# Altium schematic sheet Pcb Schemetic_Gas Detector.SchDoc
size A; SheetNumber: 1; SheetTotal: 1
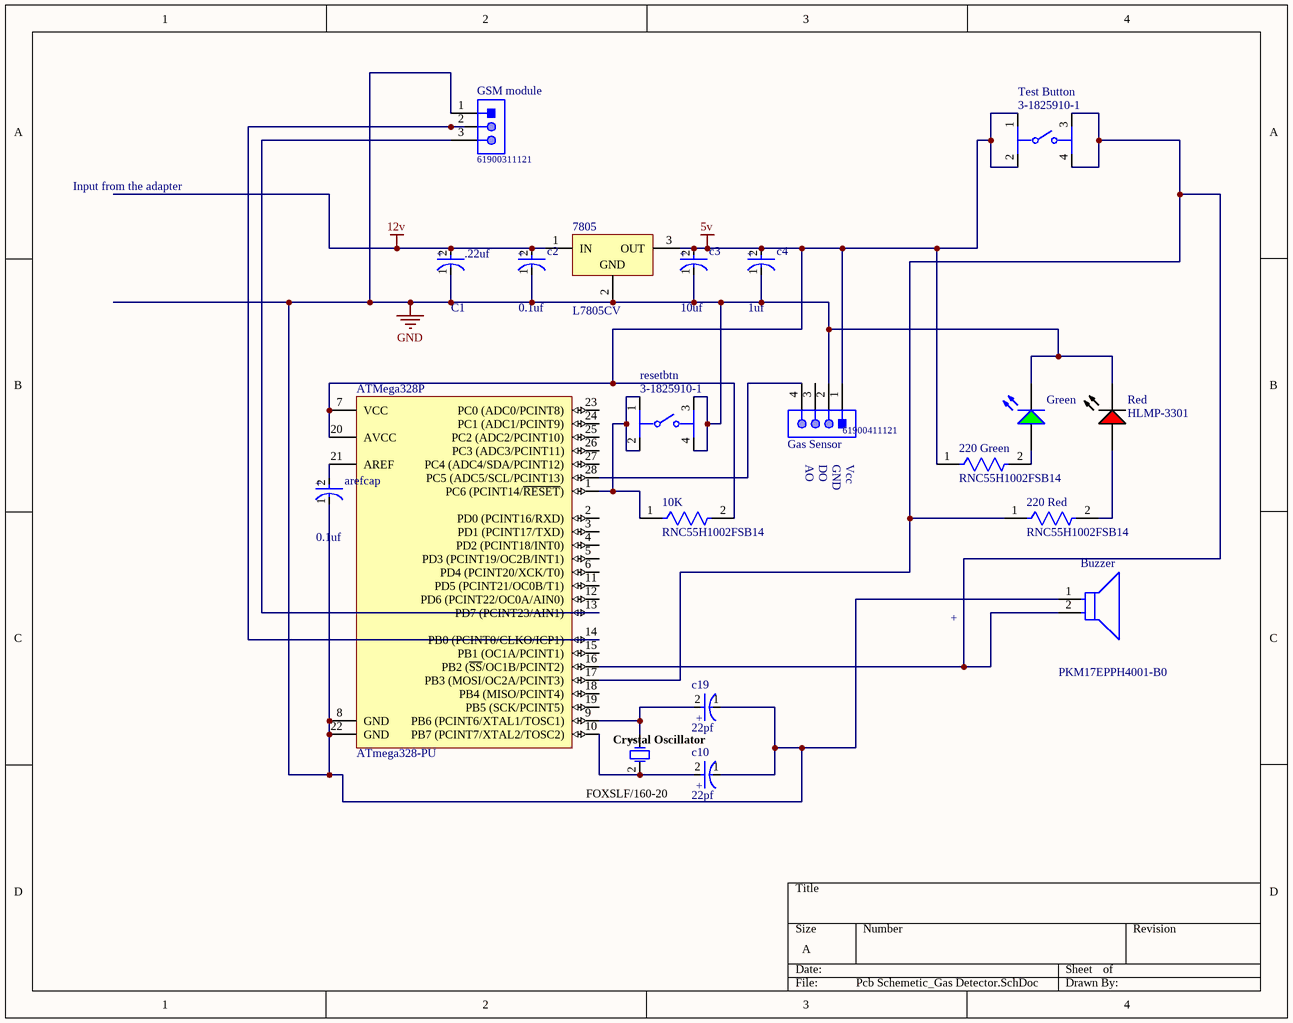
[diagram p0: Pcb Schemetic_Gas Detector.SchDoc]

## Parts
10K  RNC55H1002FSB14  [FP-RNC55-MFG]
220_Green  RNC55H1002FSB14  [FP-RNC55-MFG]
220_Red  RNC55H1002FSB14  [FP-RNC55-MFG]
7805  L7805CV  [TO220]
.22uf  C1  [FP-RAD-TH-D_12_5_0_5-L_25-MFG]
arefcap  0.1uf  [FP-RAD-TH-D_10_0_5-L_20_2-MFG]
ATMega328P  ATmega328-PU  [28P3]
Buzzer  PKM17EPPH4001-B0  [FP-PKM17EPPH4001-B0-MFG]
c2  0.1uf  [FP-RAD-TH-D_10_0_5-L_20_2-MFG]
c3  10uf  [FP-RAD-TH-D_10_0_5-L_20_2-MFG]
c4  1uf  [FP-RAD-TH-D_10_0_5-L_20_2-MFG]
c10  22pf  [FP-RAD-TH-D_10_0_5-L_20_2-MFG]
c19  22pf  [FP-RAD-TH-D_10_0_5-L_20_2-MFG]
Crystal_Oscillator  FOXSLF/160-20  [FOX-FOXSLF160-20]
Gas_Sensor  61900411121  [61900411121]
Green  (no value)  [AVAG-HLMP-3507]
GSM_module  61900311121  [61900311121]
Red  HLMP-3301  [AVAG-HLMP-3301-2]
resetbtn  3-1825910-1  [FP-3-1825910-1-MFG]
Test_Button  3-1825910-1  [FP-3-1825910-1-MFG]

## Nets
5v: 10K.2 220_Green.1 7805.3(OUT) ATMega328P.7(VCC) ATMega328P.20(AVCC) c3.2(A) c4.2(A) Gas_Sensor.1 Test_Button.1 Test_Button.2
12v: 7805.1(IN) .22uf.2(A) c2.2(A)
GND: 7805.2(GND) .22uf.1(C) arefcap.1(C) ATMega328P.8(GND) ATMega328P.22(GND) Buzzer.1 c2.1(C) c3.1(C) c4.1(C) c10.1(C) c19.1(C) Gas_Sensor.2 Green.2(K) GSM_module.1 Red.1(K) resetbtn.3 resetbtn.4
Net10K_1: 10K.1 ATMega328P.1(PC6_(PCINT14/~{RESET})) resetbtn.1 resetbtn.2
Net220_Green_2: 220_Green.2 Green.1(A)
Net220_Red_1: 220_Red.1 ATMega328P.16(PB2_(~{SS}/OC1B/PCINT2)) ATMega328P.17(PB3_(MOSI/OC2A/PCINT3)) Buzzer.2 Test_Button.3 Test_Button.4
Net220_Red_2: 220_Red.2 Red.2(A)
Netarefcap_2: arefcap.2(A) ATMega328P.21(AREF)
NetATMega328P_9: ATMega328P.9(PB6_(PCINT6/XTAL1/TOSC1)) c19.2(A) Crystal_Oscillator.1
NetATMega328P_10: ATMega328P.10(PB7_(PCINT7/XTAL2/TOSC2)) c10.2(A) Crystal_Oscillator.2
NetATMega328P_13: ATMega328P.13(PD7_(PCINT23/AIN1)) GSM_module.3
NetATMega328P_14: ATMega328P.14(PB0_(PCINT0/CLKO/ICP1)) GSM_module.2
NetATMega328P_28: ATMega328P.28(PC5_(ADC5/SCL/PCINT13)) Gas_Sensor.4

Not connected (* = marked no-connect by the designer): ATMega328P 2(PD0_(PCINT16/RXD)) 3(PD1_(PCINT17/TXD)) 4(PD2_(PCINT18/INT0)) 5(PD3_(PCINT19/OC2B/INT1)) 6(PD4_(PCINT20/XCK/T0)) 11(PD5_(PCINT21/OC0B/T1)) 12(PD6_(PCINT22/OC0A/AIN0)) 15(PB1_(OC1A/PCINT1)) 18(PB4_(MISO/PCINT4)) 19(PB5_(SCK/PCINT5)) 23(PC0_(ADC0/PCINT8)) 24(PC1_(ADC1/PCINT9)) 25(PC2_(ADC2/PCINT10)) 26(PC3_(ADC3/PCINT11)) 27(PC4_(ADC4/SDA/PCINT12)); Gas_Sensor 3

## Notes on the sheet
- Input from the adapter
- AO
- DO
- GND
- Vcc
- +
- (in symbol CMP-05427-000214-1) +
- (in symbol CMP-05427-000913-1) +

## Library data of the parts
10K 220_Green 220_Red = CMP-02408-000004-1: RES 10K OHM 1/8W 1% AXIAL; Manufacturer: Vishay; Voltage Rating: 200V; Power Rating: 0.125W; Resistance: 10kΩ; Temperature Coefficient: 50ppm/°C; Value: 10kΩ; Automotive: No; Category: Res; Tolerance: 1%; Temperature: -65°C to +175°C; Device Class L2: Resistors; Composition: Metal Film; Height: 2.69mm; Failure Rate: 0.001%; ComponentLink2URL: https://www.vishay.com/docs/31025/erc.pdf; Manufacturer Part Number: RNC55H1002FSB14; Temperature Range High: +175°C; Lead Free: No; Series: RNC; Device Class L1: Passive Components; Ipc Land Pattern Name: RESAD1100W85L762D269; Octopart: https://octopart.com/rnc55h1002fs-vishay-40848808; Package: RNC55; RoHS: FALSE; Military Standard: true; Device Class L3: Through-Hole Resistors; ComponentLink2Description: Datasheet; Digikey Description: RES 10K OHM 1/8W 1% AXIAL; Temperature Range Low: -65°C
7805 = CMP-0244-00483-1: Positive Voltage Regulator, 5V, 3-Pin TO-220; PackageDescription: TO, Thru-Hole, Vertical, Heatsink Mounted; 3 In-Line Leads; Pitch 2.54 mm; ComponentLink2Description: Datasheet; PackageReference: TO220; ComponentLink3URL: http://www.st.com/internet/com/TECHNICAL_RESOURCES/TECHNICAL_LITERATURE/PACKAGE_INFORMATION/CD00004649.pdf; DatasheetVersion: 16/11/2011; ComponentLink1Description: Manufacturer URL; ComponentLink1URL: http://www.st.com; PackageVersion: ver3.0; ComponentLink3Description: Package Specification; ComponentLink2URL: http://www.st.com/internet/com/TECHNICAL_RESOURCES/TECHNICAL_LITERATURE/DATASHEET/CD00000444.pdf
.22uf = CMP-05427-000913-1: Aluminum Electrolytic Capacitors (Radial Lead Type) 22uF ±20% 400V; Leakage Current: 538uA; Life (Hours): 10000Hour; Lead Diameter: 0.6mm; Ripple Current (AC): 760mA; Dielectric Material: Aluminium; Dissipation Factor: 0.24%; Packaging: Bulk; Tolerance: 20%; Voltage: 400V; Termination: Radial; Number of Pins: 2; REACH SVHC: No SVHC; Max Operating Temperature: 105°C; Voltage Rating: 400V; Length: 25mm; Min Operating Temperature: -25°C; Construction: RADIAL; Voltage Rating (DC): 400V; Mount: Through Hole; Lead Pitch: 5mm; Package Quantity: 200; Lead Free: Lead Free; Capacitance: 22uF; Series: EE; Radiation Hardening: No; Height: 25mm; Case/Package: Radial; Diameter: 12.5mm; Ripple Current: 760mA; Height - Seated (Max): 0.984inch; RoHS Compliant: Yes
arefcap c2-c4 c10 c19 = CMP-05427-000214-1: Aluminum Electrolytic Capacitors (Radial Lead Type) 10uF ±20% 400V; Lead/Base Style: Straight; Lead Diameter: 0.6mm; Dissipation Factor: 0.24%; Ripple Current (AC): 80mA; Life (Hours): 2000Hour; Polarity: Polar; Dielectric Material: Aluminium; Lead Free: Lead Free; Capacitance: 10uF; Tolerance: 20%; Height: 20mm; Number of Pins: 2; Case/Package: Radial; Package Quantity: 200; REACH SVHC: No SVHC; Termination: Radial; Radiation Hardening: No; Diameter: 10mm; RoHS Compliant: Yes; Construction: RADIAL; Max Operating Temperature: 105°C; Voltage Rating: 400V; Mount: Through Hole; Voltage: 400V; Height - Seated (Max): 0.866inch; Lead Pitch: 5mm; Voltage Rating (DC): 400V; Contact Plating: Tin; Length: 20mm; Series: NHG; Min Operating Temperature: -25°C; Packaging: Bulk; Ripple Current: 80mA
ATMega328P = CMP-0095-00015-2: 8-bit AVR Microcontroller, 32KB Flash, 1KB EEPROM, 2KB SRAM, 28-pin PDIP, Industrial Grade (-40°C to 85°C); ComponentLink3Description: ATmega48A/48PA/88A/88PA/168A/168PA/328/328P Summary; RevisionNote: DatasheetVersion updated. URLs added.; DatasheetVersion: revD, May-2011; ComponentLink1URL: http://www.atmel.com/; PackageVersion: revB, Sep-2001; PackageDescription: 28-lead (0.300"/7.62mm Wide) Plastic Dual Inline Package (PDIP); PackageReference: 28P3; ComponentLink1Description: Manufacturer URL; ComponentLink2Description: ATmega48A/48PA/88A/88PA/168A/168PA/328/328P Datasheet; ComponentLink3URL: http://www.atmel.com/dyn/resources/prod_documents/8271S.pdf; ComponentLink2URL: http://www.atmel.com/dyn/resources/prod_documents/8271.pdf
Buzzer = CMP-06202-000027-1: AUDIO PIEZO TRANSDUCER 25V TH; Capacitance: 7nF; Self Resonant Frequency: 4kHz; Voltage Rating: 3V; Washable: No; Package Quantity: 600; Height: 7mm; Radiation Hardening: No; Lead Free: Lead Free; Max Operating Temperature: 70°C; REACH SVHC: No SVHC; Packaging: Bulk; Min Operating Temperature: -20°C; Diameter: 17mm; Voltage Rating (DC): 25V; Max Frequency: 4kHz; Nominal Input Voltage: 3V; Mount: Through Hole; Max Supply Voltage: 25V; Frequency: 4kHz; Termination: Solder
Crystal_Oscillator = CMP-1749-00003-1: Resistance Weld Thru-Hole Crystal, 16 MHz, -20 to 70 degC, 2-Pin THD, RoHS, Bulk; Voltage Rating: 250 V; Tolerance: 1%; Resistance: 221 kohm; Case\Package: Axial; Power Rating: 250 mW; RoHSCompliant: true; Package Quantity: 200; Packaging: Bulk; Min Operating Temperature: -55 degC; DatasheetVersion: Mar-15; ComponentLink1URL: http://www.foxonline.com/; Max Operating Temperature: 155 degC; PackageReference: FOXSLF160-20; Mount: Through Hole; PackageDescription: 2-Pin Through Hole Device, Body 11.35 x 4.65 mm; ComponentLink1Description: Manufacturer URL; ComponentLink2URL: http://www.foxonline.com/pdfs/hc49slf.pdf; ComponentLink2Description: Datasheet; Length: 0.248 inch
Gas_Sensor = CMP-1502-00586-1: Male Locking Header WR-WTB, THT, Vertical, pitch 2.54 mm, 1 x 4 position; Manufacturer: Wurth Elektronik; Working Voltage: 250VAC; Pitch: 2.54mm; Contact Resistance: 20mOhm; Position: 1x4; Publisher: WurthElektronik; Manufacturer URL: http://www.we-online.de; Datasheet URL: https://katalog.we-online.de/em/datasheet/6190xx11121.pdf; Operating Temperature: -40to105degC; Packaging: Bag; Gender: Male; Package Reference: 61900411121; Orientation: Vertical; Mounting Technology: THT; Part Number: 61900411121
Green = CMP-2000-06412-1: T-1 3/4 (5 mm) Diffused LED Lamp, Green, 2.1 V, -20 to 100 degC, 2-Pin THD, RoHS, Bulk; Manufacturer: Avago; Reverse Voltage: 5V; Product Depth (mm): 6.1mm; Lum Intensity: 4.2mcd; Chip Material: GaP; Emitting Color: YellowGreen; Number of  Elements: 1; Forward Voltage: 2.7V; Dominant Wave Length: 569nm; Peak Wavelength: 565nm; Rad Hardened: No; Shape Type: Circular; Forward Current: 25mA; Product Height (mm): 9.19mm; Power Dissipation: 85W; Viewing Angle: 60deg; Main Category: StandardLED; Lens Type: ColoredDiffused; Test Current (It): 10mA; DELETED: Compliant; Package Description: 2-Pin Through Hole Device, Dia 5.845 mm, Pitch 2.54 mm; Datasheet URL: http://docs.avagotech.com/docs/AV02-1558EN; Type: Uni-Color; Operating Temperature Classification: Industrial; Pin Count: 2; Datasheet Version: 03/2015; Operating Temp Range: -40Cto100C; Package Reference: HLMP-3507; Mounting: ThroughHole; Mounting Technology: ThroughHole; Manufacturer URL: http://www.avagotech.com/; High Brightness: No; Luminous Intensity: 4.2mcd; Package Type: T-13/4; Product Length (mm): 6.1mm; Lens Dimensions: 5.08x5.08x8.3mm
GSM_module = CMP-1502-00585-1: Male Locking Header WR-WTB, THT, Vertical, pitch 2.54 mm, 1 x 3 position; Manufacturer: Wurth Elektronik; Contact Resistance: 20mOhm; Pitch: 2.54mm; Working Voltage: 250VAC; Position: 1x3; Mounting Technology: THT; Operating Temperature: -40to105degC; Part Number: 61900311121; Datasheet URL: https://katalog.we-online.de/em/datasheet/6190xx11121.pdf; Manufacturer URL: http://www.we-online.de; Publisher: WurthElektronik; Orientation: Vertical; Gender: Male; Package Reference: 61900311121; Packaging: Bag
Red = CMP-2000-06411-1: T-1 3/4 (5 mm) Diffused LED Lamp, 1.9 V, -40 to 100 degC, 2-Pin THD, RoHS, Bulk; Manufacturer: Avago; Forward Current: 25mA; Forward Voltage: 2.4V; Peak Wavelength: 635nm; Shape Type: Circular; High Brightness: No; Main Category: StandardLED; Test Current (It): 10mA; Dominant Wave Length: 626nm; Number of  Elements: 1; Reverse Voltage: 5V; Chip Material: GaP; Product Height (mm): 9.19mm; Lens Type: ColoredDiffused; Viewing Angle: 60deg; Emitting Color: Red; Luminous Intensity: 5.4mcd; Power Dissipation: 85W; DELETED: Compliant; Product Depth (mm): 6.1mm; Package Description: 2-Pin Through Hole LED, Dia 5.85 mm; Mounting Technology: ThroughHole; Manufacturer URL: http://www.avagotech.com/; Package Type: T-13/4; Operating Temp Range: -40Cto100C; Datasheet URL: http://www.avagotech.com/docs/AV02-1558EN; Mounting: ThroughHole; Lens Dimensions: 5.08x5.08x8.3mm; Package Reference: HLMP-3301; Datasheet Version: 03/2015; Pin Count: 2; Packaging: TapeandReel; Type: Uni-Color; Operating Temperature Classification: Industrial; Lum Intensity: 5.4mcd; Rad Hardened: No; Product Length (mm): 6.1mm
resetbtn Test_Button = CMP-03407-000001-1: SWITCH TACTILE SPST-NO 0.05A 24V; Manufacturer: TE Connectivity; Operating Force: 160gf; Contact Current Rating: 50mA; Contact Resistance: 100mΩ; Electromechanical Life: 100000Cycles; Device Class L1: Electromechanical; ComponentLink2URL: https://www.te.com/commerce/DocumentDelivery/DDEController?Action=srchrtrv&DocNm=1825910&DocType=Customer+Drawing&DocLang=English; Category: Switch; Device Class L2: Switches; Temperature: -35°C to +85°C; RoHS: TRUE; Mount: Through Hole; Manufacturer Part Number: 3-1825910-1; Automotive: No; Lead Free: Yes; Device Class L3: Tactile Switches; ComponentLink2Description: Datasheet; Temperature Range High: +85°C; Height: 17.3mm; Package: 0; Temperature Range Low: -35°C; Throw Configuration: SPST-NO; Digikey Description: SWITCH TACTILE SPST-NO 0.05A 24V; Octopart: https://octopart.com/3-1825910-1-te+connectivity-46506874